# EAGLE design schemat (EAGLE 8.7.1)
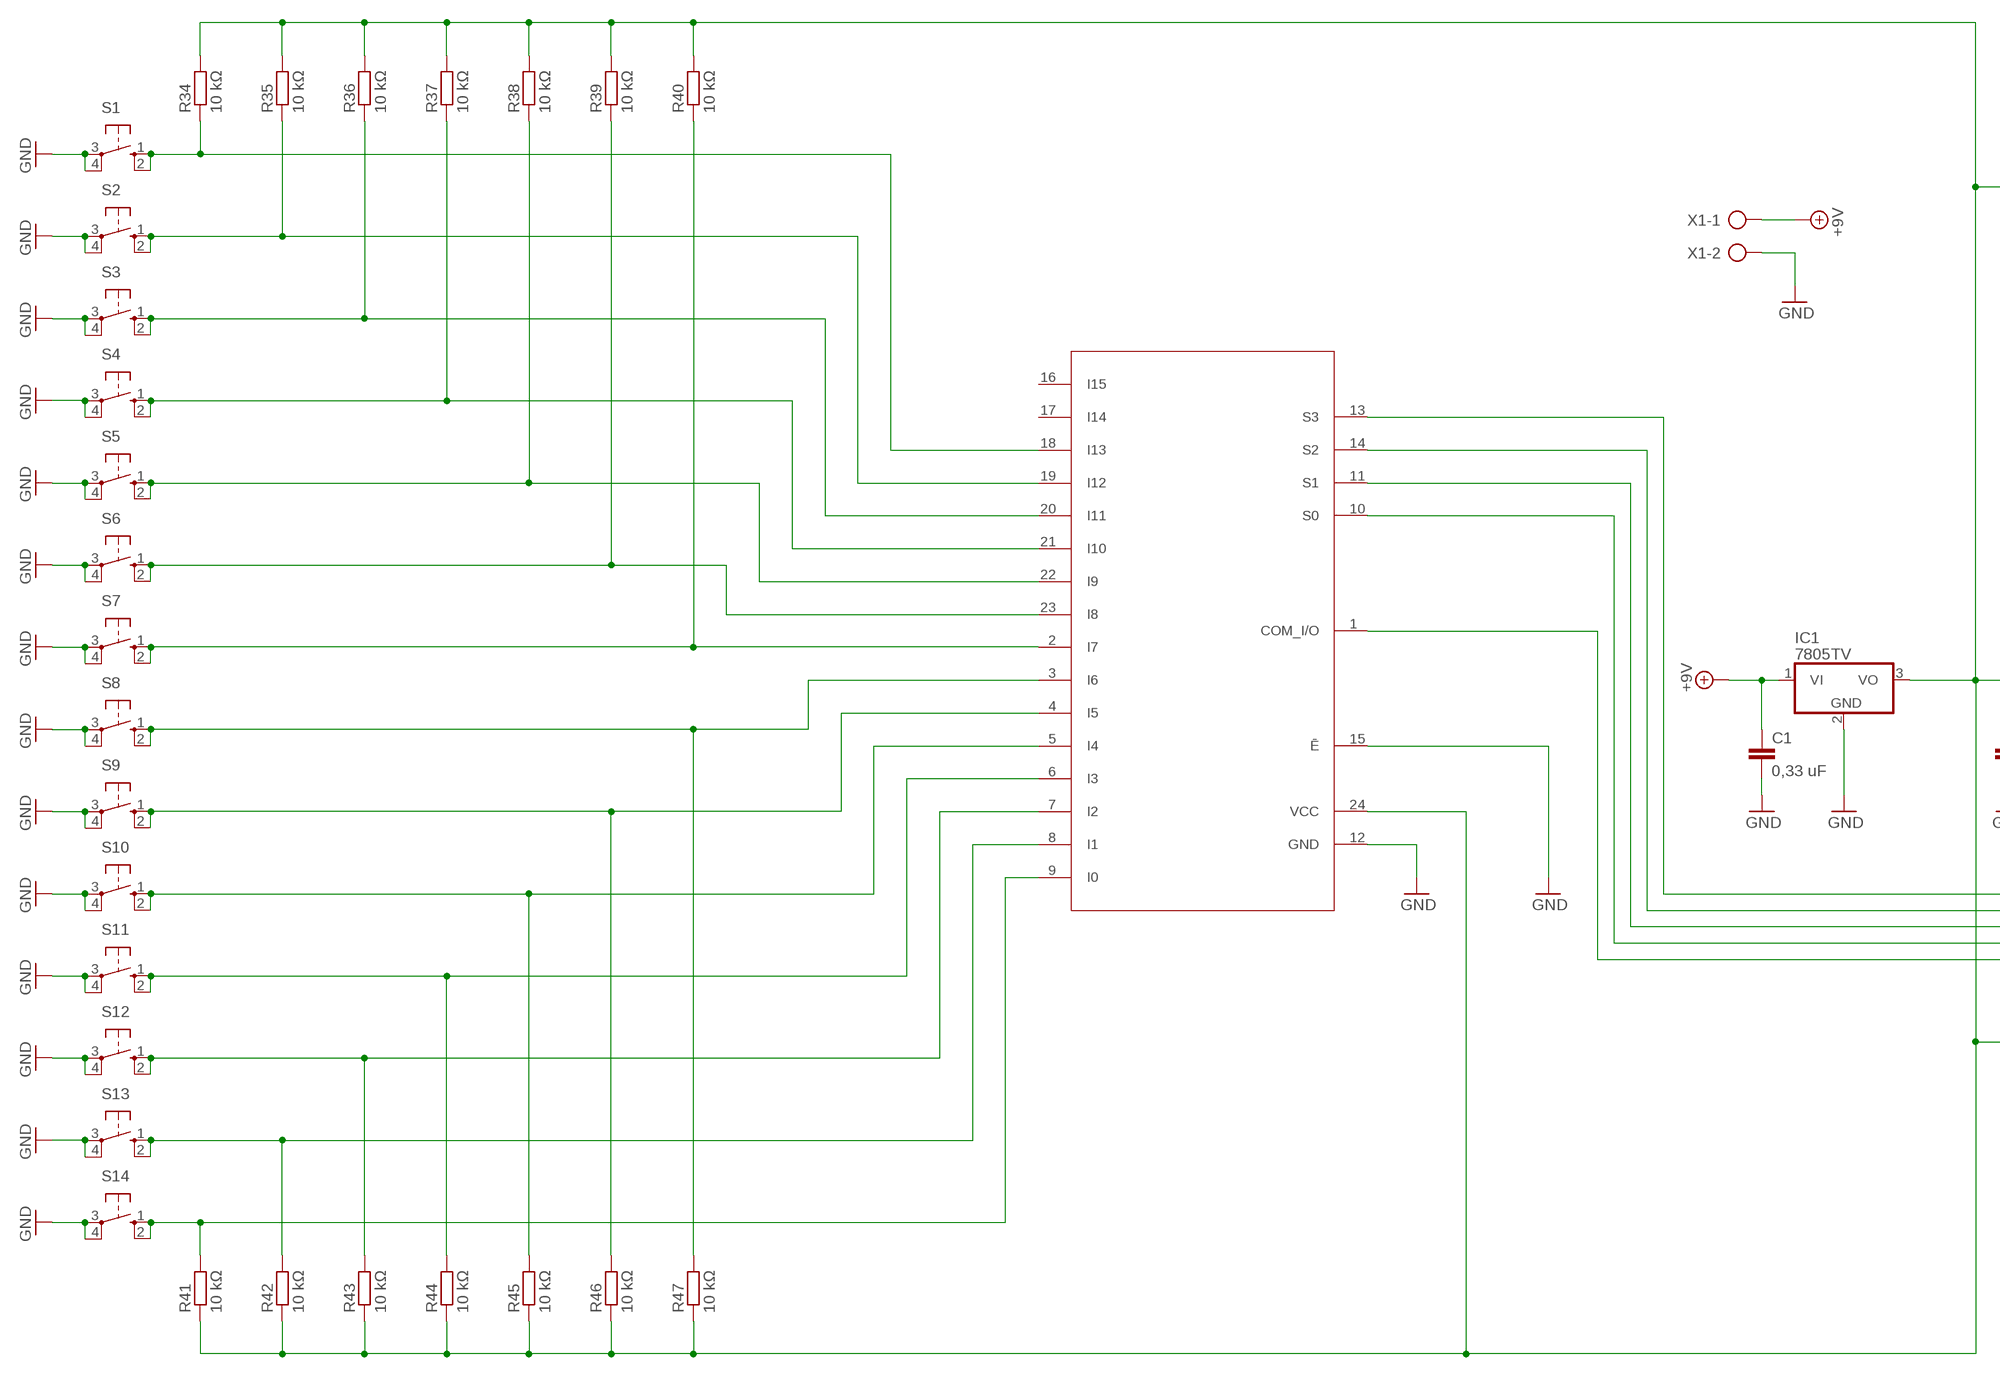
[diagram p0: schematic, sheet 1, part 1 of 2]
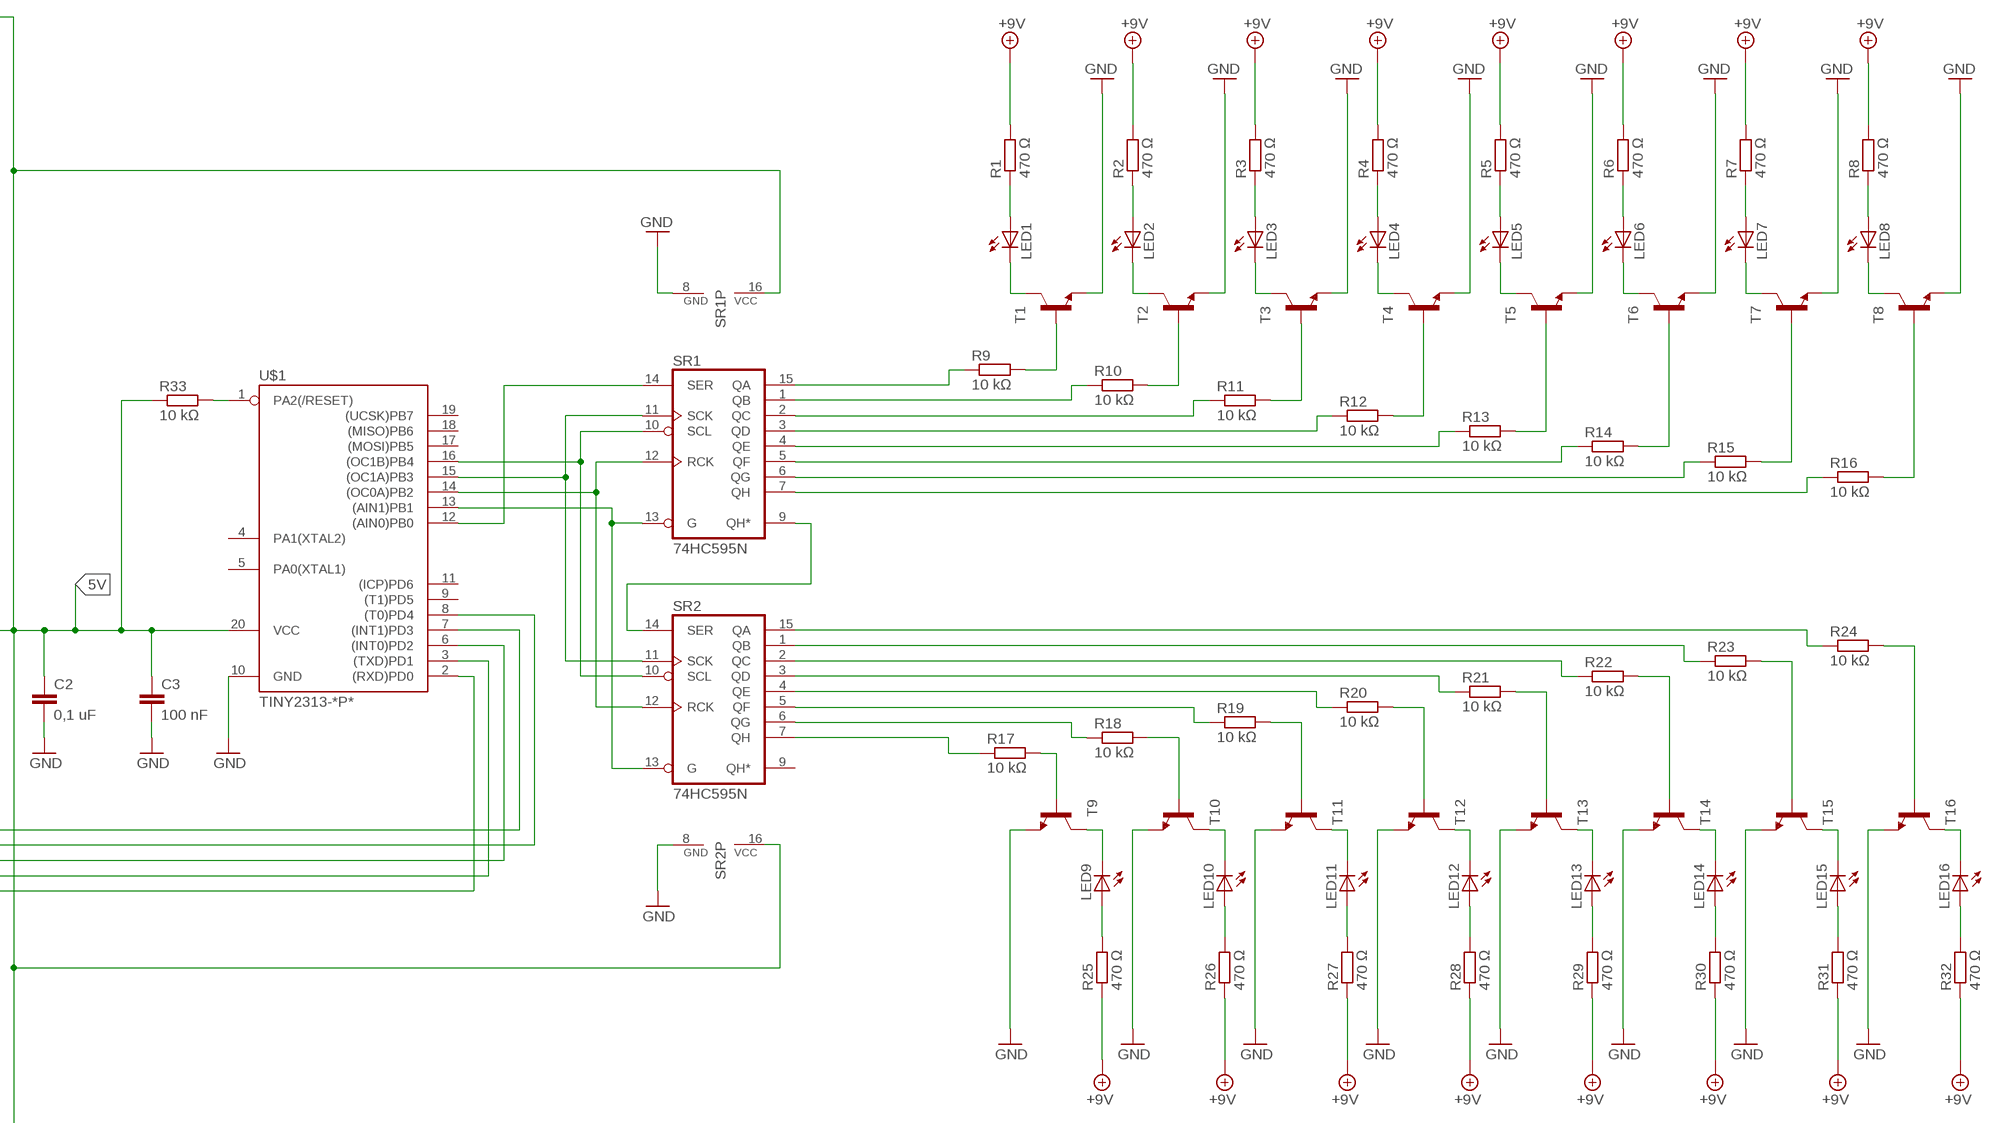
[diagram p1: schematic, sheet 1, part 2 of 2]

## Parts
C1  0,33 uF  C-EU025-024X044  [C025-024X044]
C2  0,1 uF  C-EU025-024X044  [C025-024X044]
C3  100 nF  C-EU025-024X044  [C025-024X044]
IC1  7805TV  [TO220V]
LED1  LED5MM  [LED5MM]
LED2  LED5MM  [LED5MM]
LED3  LED5MM  [LED5MM]
LED4  LED5MM  [LED5MM]
LED5  LED5MM  [LED5MM]
LED6  LED5MM  [LED5MM]
LED7  LED5MM  [LED5MM]
LED8  LED5MM  [LED5MM]
LED9  LED5MM  [LED5MM]
LED10  LED5MM  [LED5MM]
LED11  LED5MM  [LED5MM]
LED12  LED5MM  [LED5MM]
LED13  LED5MM  [LED5MM]
LED14  LED5MM  [LED5MM]
LED15  LED5MM  [LED5MM]
LED16  LED5MM  [LED5MM]
R1  470 Ω  R-EU_0207/10  [0207/10]
R2  470 Ω  R-EU_0207/10  [0207/10]
R3  470 Ω  R-EU_0207/10  [0207/10]
R4  470 Ω  R-EU_0207/10  [0207/10]
R5  470 Ω  R-EU_0207/10  [0207/10]
R6  470 Ω  R-EU_0207/10  [0207/10]
R7  470 Ω  R-EU_0207/10  [0207/10]
R8  470 Ω  R-EU_0207/10  [0207/10]
R9  10 kΩ  R-EU_0207/10  [0207/10]
R10  10 kΩ  R-EU_0207/10  [0207/10]
R11  10 kΩ  R-EU_0207/10  [0207/10]
R12  10 kΩ  R-EU_0207/10  [0207/10]
R13  10 kΩ  R-EU_0207/10  [0207/10]
R14  10 kΩ  R-EU_0207/10  [0207/10]
R15  10 kΩ  R-EU_0207/10  [0207/10]
R16  10 kΩ  R-EU_0207/10  [0207/10]
R17  10 kΩ  R-EU_0207/10  [0207/10]
R18  10 kΩ  R-EU_0207/10  [0207/10]
R19  10 kΩ  R-EU_0207/10  [0207/10]
R20  10 kΩ  R-EU_0207/10  [0207/10]
R21  10 kΩ  R-EU_0207/10  [0207/10]
R22  10 kΩ  R-EU_0207/10  [0207/10]
R23  10 kΩ  R-EU_0207/10  [0207/10]
R24  10 kΩ  R-EU_0207/10  [0207/10]
R25  470 Ω  R-EU_0207/10  [0207/10]
R26  470 Ω  R-EU_0207/10  [0207/10]
R27  470 Ω  R-EU_0207/10  [0207/10]
R28  470 Ω  R-EU_0207/10  [0207/10]
R29  470 Ω  R-EU_0207/10  [0207/10]
R30  470 Ω  R-EU_0207/10  [0207/10]
R31  470 Ω  R-EU_0207/10  [0207/10]
R32  470 Ω  R-EU_0207/10  [0207/10]
R33  10 kΩ  R-EU_0207/10  [0207/10]
R34  10 kΩ  R-EU_0207/10  [0207/10]
R35  10 kΩ  R-EU_0207/10  [0207/10]
R36  10 kΩ  R-EU_0207/10  [0207/10]
R37  10 kΩ  R-EU_0207/10  [0207/10]
R38  10 kΩ  R-EU_0207/10  [0207/10]
R39  10 kΩ  R-EU_0207/10  [0207/10]
R40  10 kΩ  R-EU_0207/10  [0207/10]
R41  10 kΩ  R-EU_0207/10  [0207/10]
R42  10 kΩ  R-EU_0207/10  [0207/10]
R43  10 kΩ  R-EU_0207/10  [0207/10]
R44  10 kΩ  R-EU_0207/10  [0207/10]
R45  10 kΩ  R-EU_0207/10  [0207/10]
R46  10 kΩ  R-EU_0207/10  [0207/10]
R47  10 kΩ  R-EU_0207/10  [0207/10]
S1  40-XX  [B3F-40XX]
S2  40-XX  [B3F-40XX]
S3  40-XX  [B3F-40XX]
S4  40-XX  [B3F-40XX]
S5  40-XX  [B3F-40XX]
S6  40-XX  [B3F-40XX]
S7  40-XX  [B3F-40XX]
S8  40-XX  [B3F-40XX]
S9  40-XX  [B3F-40XX]
S10  40-XX  [B3F-40XX]
S11  40-XX  [B3F-40XX]
S12  40-XX  [B3F-40XX]
S13  40-XX  [B3F-40XX]
S14  40-XX  [B3F-40XX]
SR1  74HC595N  [DIL16]
SR2  74HC595N  [DIL16]
T1  -NPN-TO92  [TO92]
T2  -NPN-TO92  [TO92]
T3  -NPN-TO92  [TO92]
T4  -NPN-TO92  [TO92]
T5  -NPN-TO92  [TO92]
T6  -NPN-TO92  [TO92]
T7  -NPN-TO92  [TO92]
T8  -NPN-TO92  [TO92]
T9  -NPN-TO92  [TO92]
T10  -NPN-TO92  [TO92]
T11  -NPN-TO92  [TO92]
T12  -NPN-TO92  [TO92]
T13  -NPN-TO92  [TO92]
T14  -NPN-TO92  [TO92]
T15  -NPN-TO92  [TO92]
T16  -NPN-TO92  [TO92]
U$1  TINY2313-*P*  [DIL20]
U$2  CD74HC4067  [DIL24-6]
X1  AK500/2  [AK500/2]

## Nets
5V: C2.1 C3.1 IC1.3(VO) R33.1 R34.2 R35.2 R36.2 R37.2 R38.2 R39.2 R40.2 R41.1 R42.1 R43.1 R44.1 R45.1 R46.1 R47.1 SR1.16(VCC) SR2.16(VCC) U$1.20(VCC) U$2.24(VCC)
+9V: C1.1 IC1.1(VI) R1.2 R2.2 R3.2 R4.2 R5.2 R6.2 R7.2 R8.2 R25.1 R26.1 R27.1 R28.1 R29.1 R30.1 R31.1 R32.1 X1.1
GND: C1.2 C2.2 C3.2 IC1.2(GND) S1.3(P) S1.4(P1) S2.3(P) S2.4(P1) S3.3(P) S3.4(P1) S4.3(P) S4.4(P1) S5.3(P) S5.4(P1) S6.3(P) S6.4(P1) S7.3(P) S7.4(P1) S8.3(P) S8.4(P1) S9.3(P) S9.4(P1) S10.3(P) S10.4(P1) S11.3(P) S11.4(P1) S12.3(P) S12.4(P1) S13.3(P) S13.4(P1) S14.3(P) S14.4(P1) SR1.8(GND) SR2.8(GND) T1.1(E) T2.1(E) T3.1(E) T4.1(E) T5.1(E) T6.1(E) T7.1(E) T8.1(E) T9.1(E) T10.1(E) T11.1(E) T12.1(E) T13.1(E) T14.1(E) T15.1(E) T16.1(E) U$1.10(GND) U$2.12(GND) U$2.15(Ē) X1.2
N$1: SR1.9(QH*) SR2.14(SER)
N$2: SR1.12(RCK) SR2.12(RCK) U$1.14((OC0A)PB2)
N$3: R33.2 U$1.1(PA2(/RESET))
N$4: R42.2 S13.1(S) S13.2(S1) U$2.8(I1)
N$5: R43.2 S12.1(S) S12.2(S1) U$2.7(I2)
N$6: SR1.10(SCL) SR2.10(SCL) U$1.16((OC1B)PB4)
N$7: LED1.A R1.1
N$8: R9.2 T1.2(B)
N$9: R10.1 SR1.1(QB)
N$10: R10.2 T2.2(B)
N$11: R9.1 SR1.15(QA)
N$12: R11.2 T3.2(B)
N$13: R11.1 SR1.2(QC)
N$14: R12.2 T4.2(B)
N$15: R12.1 SR1.3(QD)
N$16: R13.2 T5.2(B)
N$17: R13.1 SR1.4(QE)
N$18: R14.1 SR1.5(QF)
N$19: R14.2 T6.2(B)
N$20: R15.2 T7.2(B)
N$21: R16.2 T8.2(B)
N$22: R15.1 SR1.6(QG)
N$23: R16.1 SR1.7(QH)
N$24: LED1.K(C) T1.3(C)
N$25: LED2.K(C) T2.3(C)
N$26: LED3.K(C) T3.3(C)
N$27: LED4.K(C) T4.3(C)
N$28: LED5.K(C) T5.3(C)
N$29: LED6.K(C) T6.3(C)
N$30: LED7.K(C) T7.3(C)
N$31: LED8.K(C) T8.3(C)
N$32: LED2.A R2.1
N$33: LED3.A R3.1
N$34: LED4.A R4.1
N$35: LED5.A R5.1
N$36: LED6.A R6.1
N$37: LED7.A R7.1
N$38: LED8.A R8.1
N$39: LED9.A R25.2
N$40: R17.2 T9.2(B)
N$41: LED9.K(C) T9.3(C)
N$42: LED10.K(C) T10.3(C)
N$43: LED11.K(C) T11.3(C)
N$44: LED12.K(C) T12.3(C)
N$45: LED13.K(C) T13.3(C)
N$46: LED14.K(C) T14.3(C)
N$47: LED15.K(C) T15.3(C)
N$48: LED16.K(C) T16.3(C)
N$49: R17.1 SR2.7(QH)
N$50: R18.1 SR2.6(QG)
N$51: R18.2 T10.2(B)
N$52: R19.1 SR2.5(QF)
N$53: R19.2 T11.2(B)
N$54: R20.2 T12.2(B)
N$55: R20.1 SR2.4(QE)
N$56: R21.2 T13.2(B)
N$57: R21.1 SR2.3(QD)
N$58: R22.2 T14.2(B)
N$59: R22.1 SR2.2(QC)
N$60: R23.2 T15.2(B)
N$61: R23.1 SR2.1(QB)
N$62: R24.2 T16.2(B)
N$63: R24.1 SR2.15(QA)
N$64: LED10.A R26.2
N$65: LED11.A R27.2
N$66: LED12.A R28.2
N$67: LED13.A R29.2
N$68: LED14.A R30.2
N$69: LED15.A R31.2
N$70: LED16.A R32.2
N$73: R41.2 S14.1(S) S14.2(S1) U$2.9(I0)
N$75: SR1.13(G) SR2.13(G) U$1.13((AIN1)PB1)
N$76: R44.2 S11.1(S) S11.2(S1) U$2.6(I3)
N$77: SR1.11(SCK) SR2.11(SCK) U$1.15((OC1A)PB3)
N$78: R45.2 S10.1(S) S10.2(S1) U$2.5(I4)
N$80: R46.2 S9.1(S) S9.2(S1) U$2.4(I5)
N$82: R47.2 S8.1(S) S8.2(S1) U$2.3(I6)
N$83: R34.1 S1.1(S) S1.2(S1) U$2.18(I13)
N$84: R35.1 S2.1(S) S2.2(S1) U$2.19(I12)
N$85: R36.1 S3.1(S) S3.2(S1) U$2.20(I11)
N$87: R37.1 S4.1(S) S4.2(S1) U$2.21(I10)
N$89: R38.1 S5.1(S) S5.2(S1) U$2.22(I9)
N$91: R39.1 S6.1(S) S6.2(S1) U$2.23(I8)
N$93: R40.1 S7.1(S) S7.2(S1) U$2.2(I7)
N$98: U$1.2((RXD)PD0) U$2.1(COM_I/O)
N$99: U$1.3((TXD)PD1) U$2.10(S0)
N$100: U$1.6((INT0)PD2) U$2.11(S1)
N$101: U$1.8((T0)PD4) U$2.14(S2)
N$102: U$1.7((INT1)PD3) U$2.13(S3)
N$103: SR1.14(SER) U$1.12((AIN0)PB0)
Unconnected: SR2.9(QH*) U$1.4(PA1(XTAL2)) U$1.5(PA0(XTAL1)) U$1.9((T1)PD5) U$1.11((ICP)PD6) U$1.17((MOSI)PB5) U$1.18((MISO)PB6) U$1.19((UCSK)PB7) U$2.16(I15) U$2.17(I14)

## Library data of the parts
C1-C3 = rcl:C-EU: CAPACITOR, European symbol; SPICEPREFIX: C
IC1 = linear:78*: Positive VOLTAGE REGULATOR Source: http://cache.national.com/ds/LM/LM78L05.pdf http://www.fairchildsemi.com/ds/LM/LM7805.pdf
LED1-LED16 = led:LED: LED OSRAM: - CHIPLED LG R971, LG N971, LY N971, LG Q971, LY Q971, LO R971, LY R971 LH N974, LH R974 LS Q976, LO Q976, LY Q976 LO Q996 - Hyper CHIPLED LW Q18S LB Q993, LB Q99A, LB R99A - SideLED LS A670, LO A670, LY A670, LG A670, LP A670 LB A673, LV A673, LT A673, LW A673 LH A674 LY A675 LS A676, LA A676, LO A676, LY A676, LW A676 LS A679, LY A679, LG A679 - Hyper Micro SIDELED® LS Y876, LA Y876, LO Y876, LY Y876 LT Y87S - SmartLED LW L88C, LW L88S LB L89C, LB L89S, LG L890 LS L89K, LO L89K, LY L89K LS L896, LA L896, LO L896, LY L896 - TOPLED LS T670, LO T670, LY T670, LG T670, LP T670 LSG T670, LSP T670, LSY T670, LOP T670, LYG T670 LG T671, LOG T671, LSG T671 LB T673, LV T673, LT T673, LW T673 LH T674 LS T676, LA T676, LO T676, LY T676, LB T676, LH T676, LSB T676, LW T676 LB T67C, LV T67C, LT T67C, LS T67K, LO T67K, LY T67K, LW E67C LS E67B, LA E67B, LO E67B, LY E67B, LB E67C, LV E67C, LT E67C LW T67C LS T679, LY T679, LG T679 LS T770, LO T770, LY T770, LG T770, LP T770 LB T773, LV T773, LT T773, LW T773 LH T774 LS E675, LA E675, LY E675, LS T675 LS T776, LA T776, LO T776, LY T776, LB T776 LHGB T686 LT T68C, LB T68C - Hyper Mini TOPLED® LB M676 - Mini TOPLED Santana® LG M470 LS M47K, LO M47K, LY M47K Source: http://www.osram.convergy.de LUXEON: - LUMILED® LXK2-PW12-R00, LXK2-PW12-S00, LXK2-PW14-U00, LXK2-PW14-V00 LXK2-PM12-R00, LXK2-PM12-S00, LXK2-PM14-U00 LXK2-PE12-Q00, LXK2-PE12-R00, LXK2-PE12-S00, LXK2-PE14-T00, LXK2-PE14-U00 LXK2-PB12-K00, LXK2-PB12-L00, LXK2-PB12-M00, LXK2-PB14-N00, LXK2-PB14-P00, LXK2-PB14-Q00 LXK2-PR12-L00, LXK2-PR12-M00, LXK2-PR14-Q00, LXK2-PR14-R00 LXK2-PD12-Q00, LXK2-PD12-R00, LXK2-PD12-S00 LXK2-PH12-R00, LXK2-PH12-S00 LXK2-PL12-P00, LXK2-PL12-Q00, LXK2-PL12-R00 Source: www.luxeon.com KINGBRIGHT: KA-3528ASYC Source: www.kingbright.com
R1-R47 = rcl:R-EU_: RESISTOR, European symbol; SPICEPREFIX: R
S1-S14 = switch-omron:40-XX: OMRON SWITCH; MF: OMRON COMPONENTS USA; MPN: B3F-4000; OC_FARNELL: 176434; OC_NEWARK: 36K3105
SR1 = 74xx-eu:74*595: 8-bit SHIFT REGISTER, output latch; SPICEPREFIX: I
SR2 = 74xx-eu:74*595: 8-bit SHIFT REGISTER, output latch
T1-T16 = transistor:*-NPN-: NPN Transistror BF959 corrected 2008.03.06
U$1 = avr-6:TINY2313*: Atmel Tiny2313 2K Flash, 128 bytes EEPROM, 128 bytes RAM
U$2 = _mux:CD74HC4067
X1 = con-ptr500:AK500/2: CONNECTOR; OC_FARNELL: unknown; OC_NEWARK: unknown

## Board
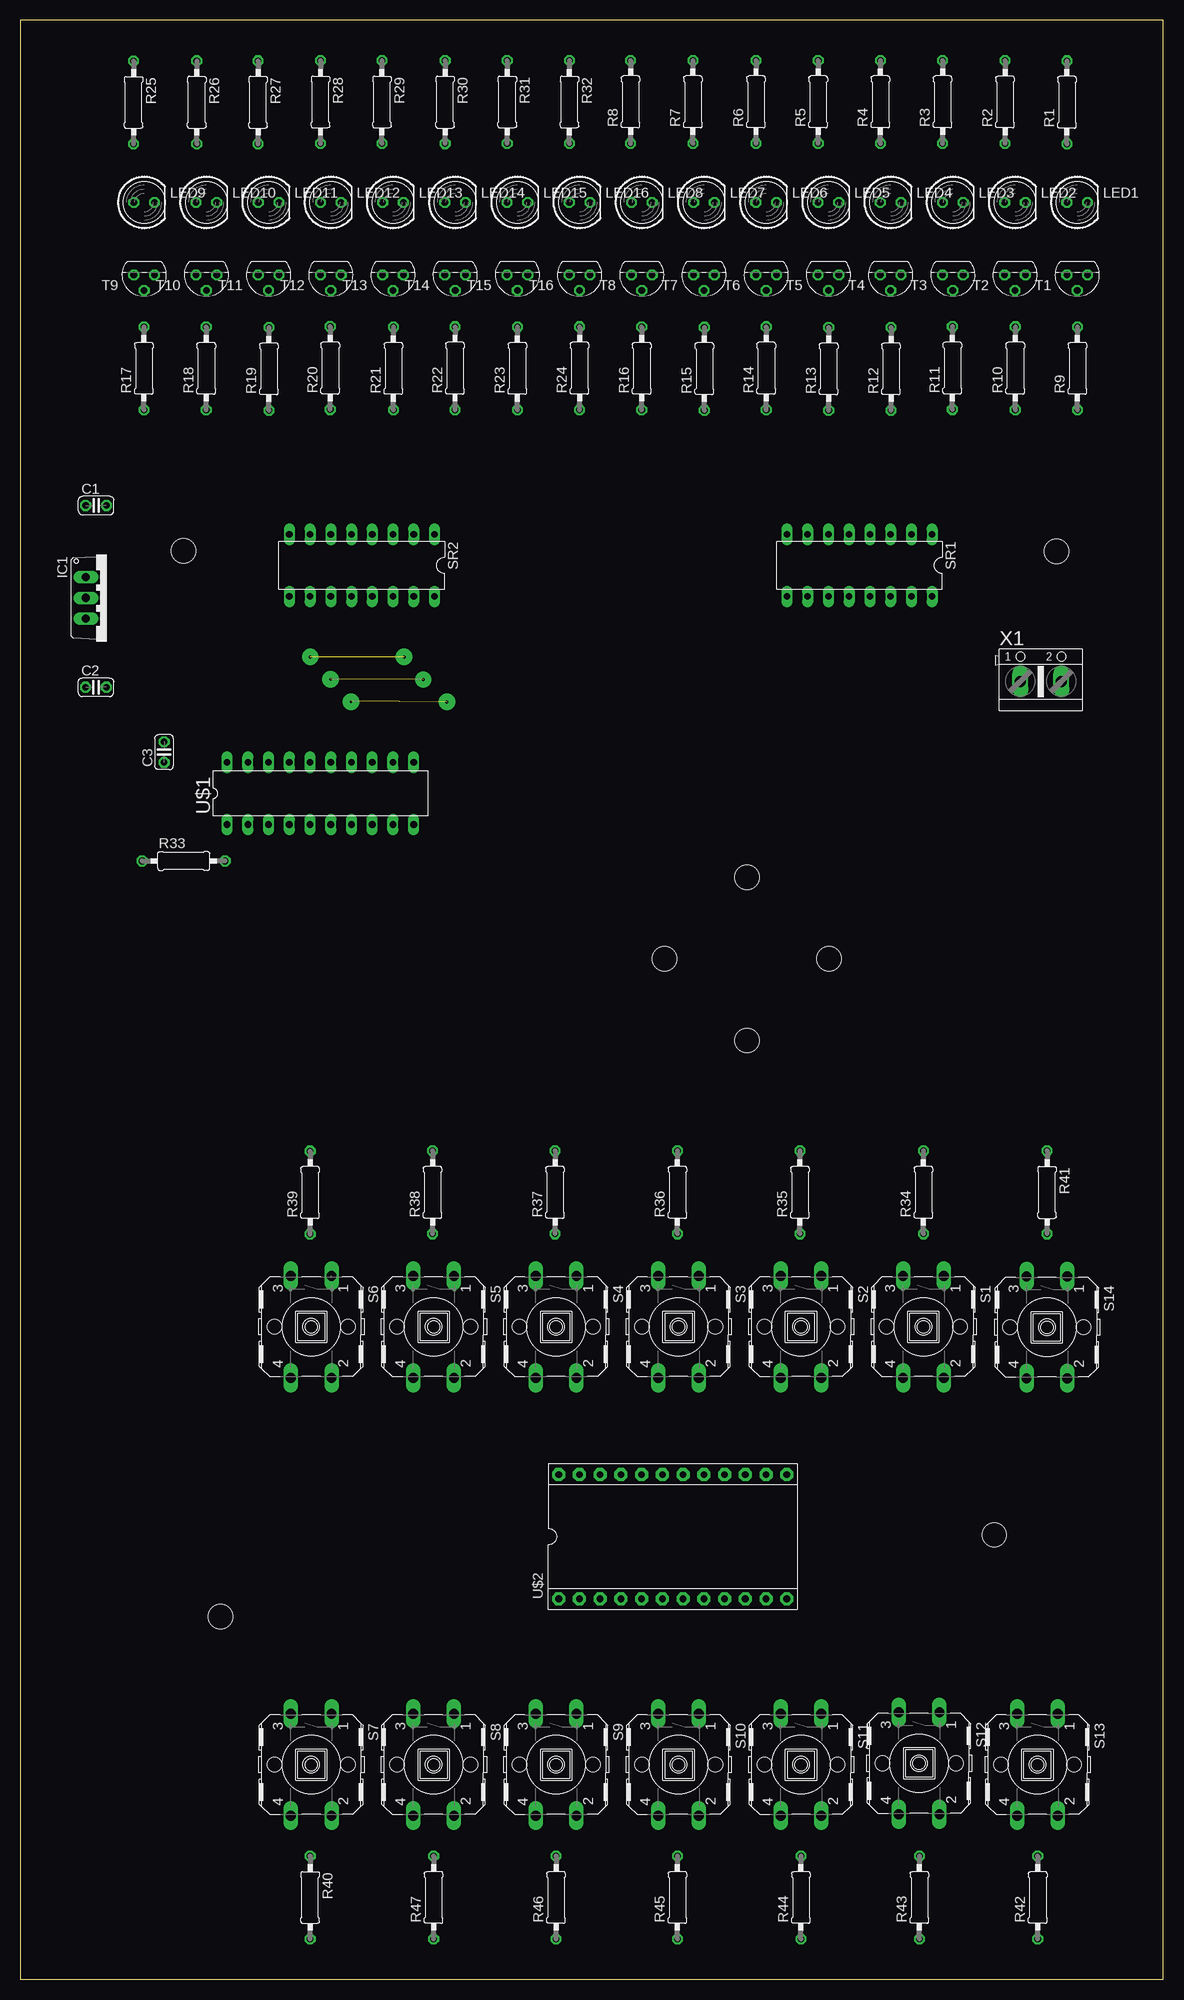
[diagram p2: board, top side]
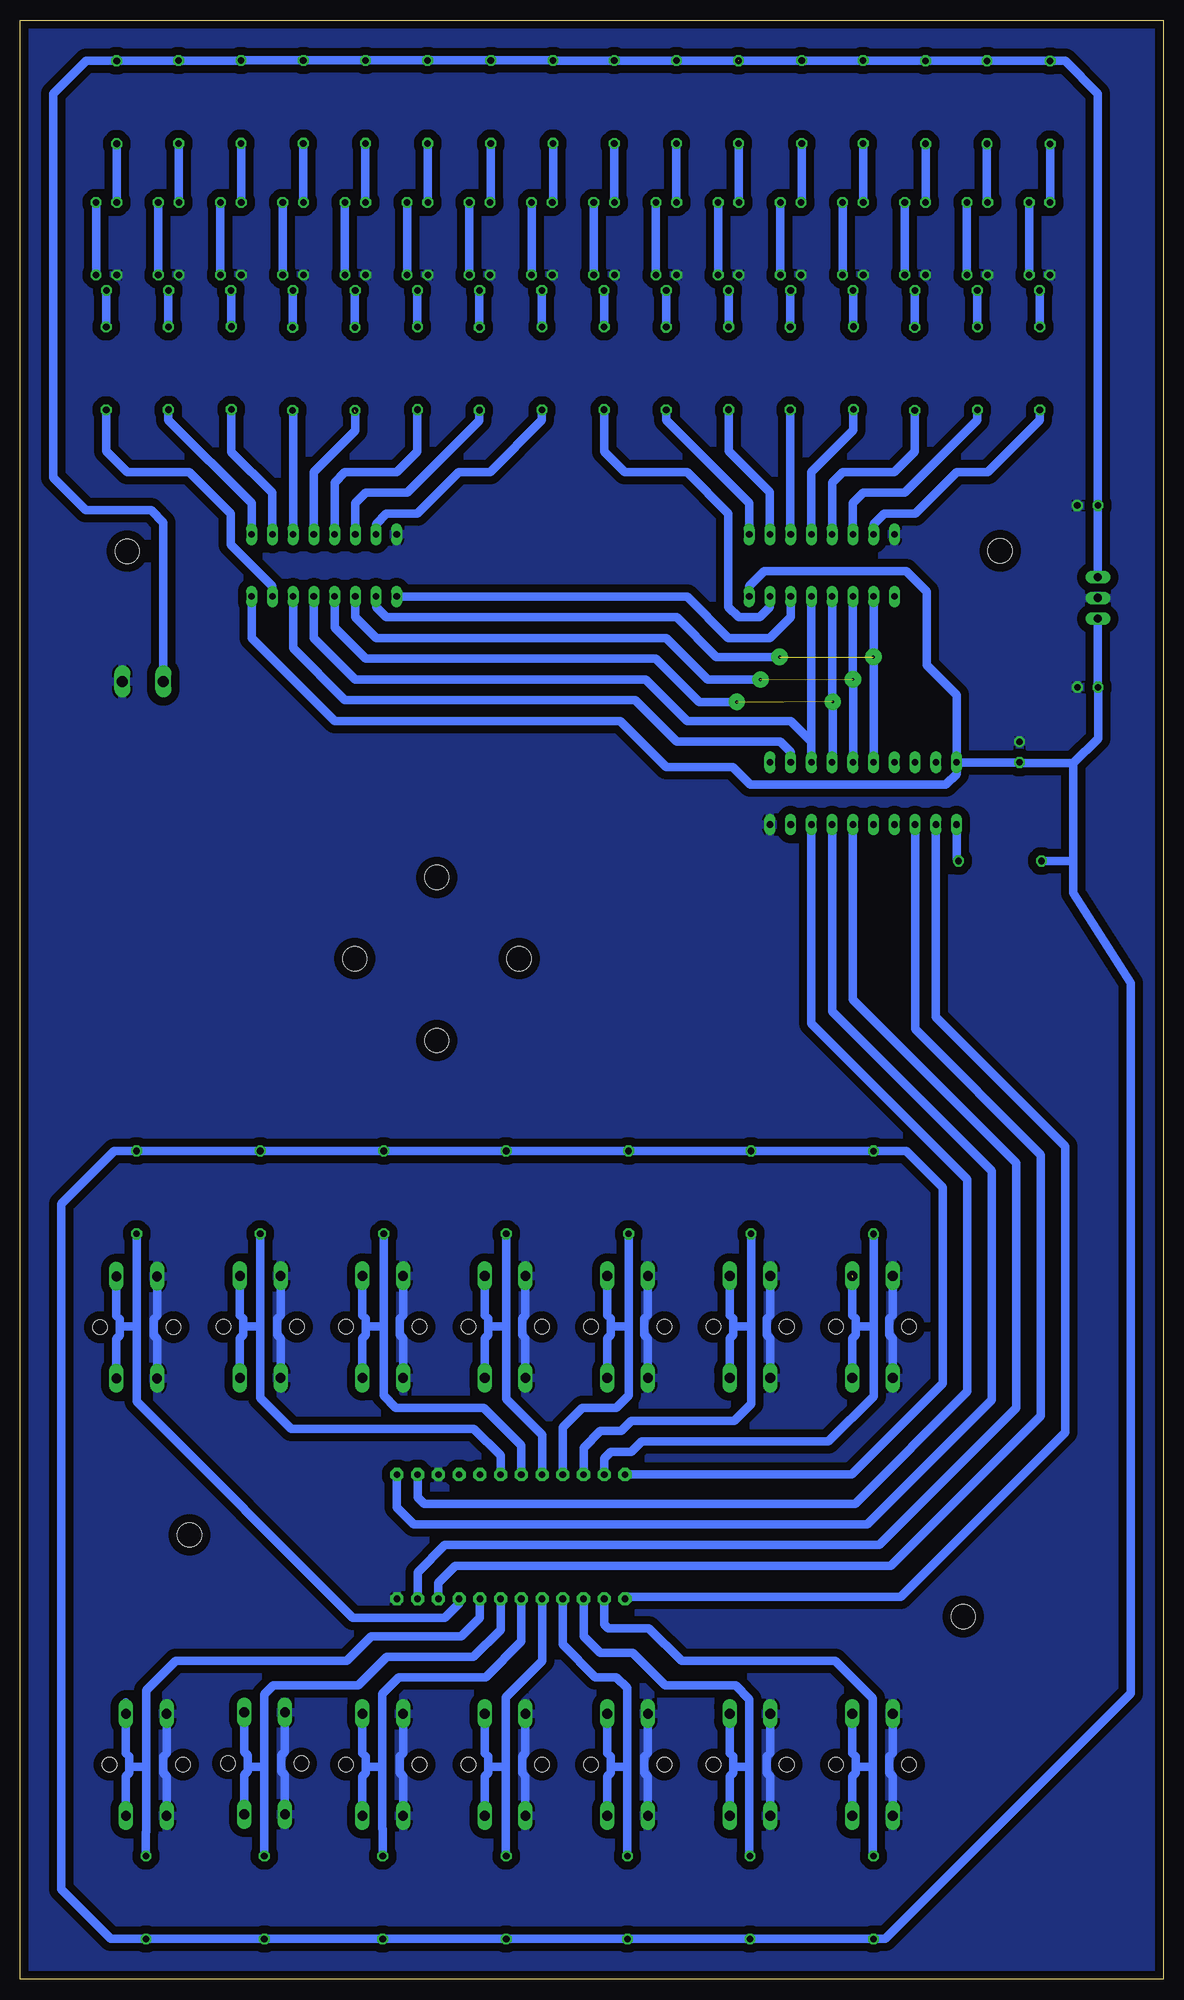
[diagram p3: board, bottom side, seen from below]

Size 140 x 240 mm. Coordinates in mm from the lower left corner, seen from the top.
Outline: 0,0 140,0 140,240 0,240 0,0
Copper layers (1*16): Top 0.035mm / dielectric 1.5mm / Bottom 0.035mm
Design rules "default": minimum track width 6mil, minimum drill 0.35mm, track to track 6mil, track to pad 6mil, pad to pad 6mil, via to via 6mil, smd to smd 6mil, copper to edge 40mil, drill to drill 6mil, minimum pad ring 10mil, minimum via ring 8mil, stop-mask expansion 4mil, vias tented up to drill 0mil, thermal gap 10mil
Holes 3 mm at 19.99,175 126.92,174.96 24.51,44.42 119.28,54.43 78.92,125.03 99.04,125.03 89,135 89,115

### Footprints (pad centres in the part's own frame; a part is rotated, then mirrored left to right if it is on the bottom)
C025-024X044 = drill 0.813 octagon: 1 -1.27,0; 2 1.27,0
TO220V = drill 1.016 long: 1 -2.54,-2.54; 2 0,-2.54; 3 2.54,-2.54
LED5MM = drill 0.813 octagon: A -1.27,0; K 1.27,0
0207/10 = drill 0.813 octagon: 1 -5.08,0; 2 5.08,0
B3F-40XX = drill 1.194 long: 1 -6.248,2.489; 2 6.248,2.489; 3 -6.248,-2.489; 4 6.248,-2.489 | hole 1.803: 0,-4.496; 0,4.496
DIL16 = drill 0.813 long: 1 -8.89,-3.81; 2 -6.35,-3.81; 3 -3.81,-3.81; 4 -1.27,-3.81; 5 1.27,-3.81; 6 3.81,-3.81; 7 6.35,-3.81; 8 8.89,-3.81; 9 8.89,3.81; 10 6.35,3.81; 11 3.81,3.81; 12 1.27,3.81; 13 -1.27,3.81; 14 -3.81,3.81; 15 -6.35,3.81; 16 -8.89,3.81
TO92 = drill 0.813 octagon: 1 1.27,0; 2 0,1.905; 3 -1.27,0
DIL20 = drill 0.813 long: 1 -11.43,-3.81; 2 -8.89,-3.81; 3 -6.35,-3.81; 4 -3.81,-3.81; 5 -1.27,-3.81; 6 1.27,-3.81; 7 3.81,-3.81; 8 6.35,-3.81; 9 8.89,-3.81; 10 11.43,-3.81; 11 11.43,3.81; 12 8.89,3.81; 13 6.35,3.81; 14 3.81,3.81; 15 1.27,3.81; 16 -1.27,3.81; 17 -3.81,3.81; 18 -6.35,3.81; 19 -8.89,3.81; 20 -11.43,3.81
DIL24-6 = drill 0.813 pad 1.6 octagon: 1 -13.97,-7.62; 2 -11.43,-7.62; 3 -8.89,-7.62; 4 -6.35,-7.62; 5 -3.81,-7.62; 6 -1.27,-7.62; 7 1.27,-7.62; 8 3.81,-7.62; 9 6.35,-7.62; 10 8.89,-7.62; 11 11.43,-7.62; 12 13.97,-7.62; 13 13.97,7.62; 14 11.43,7.62; 15 8.89,7.62; 16 6.35,7.62; 17 3.81,7.62; 18 1.27,7.62; 19 -1.27,7.62; 20 -3.81,7.62; 21 -6.35,7.62; 22 -8.89,7.62; 23 -11.43,7.62; 24 -13.97,7.62
AK500/2 = drill 1.321 long: 1 -2.515,0; 2 2.515,0

### Placement (x,y rotation side)
C1  9.27,180.55 0 top
C2  9.26,158.3 0 top
C3  17.61,150.34 90 top
IC1  10.55,169.24 270 top
LED1  129.46,217.7 0 top
LED2  121.84,217.7 0 top
LED3  114.22,217.7 0 top
LED4  106.6,217.7 0 top
LED5  98.98,217.7 0 top
LED6  91.36,217.7 0 top
LED7  83.74,217.7 0 top
LED8  76.12,217.7 0 top
LED9  15.16,217.7 0 top
LED10  22.78,217.7 0 top
LED11  30.4,217.7 0 top
LED12  38.02,217.7 0 top
LED13  45.64,217.7 0 top
LED14  53.26,217.7 0 top
LED15  60.88,217.7 0 top
LED16  68.5,217.7 0 top
R1  128.21,229.97 90 top
R2  120.62,230 90 top
R3  112.97,230.02 90 top
R4  105.35,230.02 90 top
R5  97.73,230.02 90 top
R6  90.11,230.02 90 top
R7  82.38,230.02 90 top
R8  74.75,230.02 90 top
R9  129.49,197.37 90 top
R10  121.87,197.38 90 top
R11  114.16,197.4 90 top
R12  106.65,197.3 90 top
R13  99.02,197.3 90 top
R14  91.36,197.38 90 top
R15  83.78,197.32 90 top
R16  76.11,197.37 90 top
R17  15.13,197.37 90 top
R18  22.76,197.37 90 top
R19  30.44,197.3 90 top
R20  37.95,197.4 90 top
R21  45.7,197.35 90 top
R22  53.24,197.38 90 top
R23  60.89,197.35 90 top
R24  68.49,197.38 90 top
R25  13.86,229.95 270 top
R26  21.6,229.97 270 top
R27  29.11,229.97 270 top
R28  36.76,230 270 top
R29  44.29,230 270 top
R30  52.03,229.98 270 top
R31  59.63,230 270 top
R32  67.25,230 270 top
R33  20,137 0 top
R34  110.62,96.4 90 top
R35  95.49,96.4 90 top
R36  80.49,96.4 90 top
R37  65.49,96.4 90 top
R38  50.49,96.4 90 top
R39  35.49,96.38 90 top
R40  35.49,10 270 top
R41  125.76,96.4 270 top
R42  124.62,10 90 top
R43  110.13,10 90 top
R44  95.62,10 90 top
R45  80.49,10 90 top
R46  65.62,10 90 top
R47  50.62,10 90 top
S1  110.62,79.92 270 top
S2  95.62,79.92 270 top
S3  80.62,79.92 270 top
S4  65.62,79.92 270 top
S5  50.62,79.92 270 top
S6  35.62,79.92 270 top
S7  35.62,26.27 270 top
S8  50.62,26.27 270 top
S9  65.62,26.27 270 top
S10  80.62,26.27 270 top
S11  95.62,26.27 270 top
S12  110.09,26.44 270 top
S13  124.59,26.27 270 top
S14  125.75,79.86 270 top
SR1  102.79,173.22 180 top
SR2  41.83,173.22 180 top
T1  129.46,208.81 180 top
T2  121.84,208.81 180 top
T3  114.22,208.81 180 top
T4  106.6,208.81 180 top
T5  98.98,208.81 180 top
T6  91.36,208.81 180 top
T7  83.74,208.81 180 top
T8  76.12,208.81 180 top
T9  15.16,208.81 180 top
T10  22.78,208.81 180 top
T11  30.4,208.81 180 top
T12  38.02,208.81 180 top
T13  45.64,208.81 180 top
T14  53.26,208.81 180 top
T15  60.88,208.81 180 top
T16  68.5,208.81 180 top
U$1  36.75,145.28 0 top
U$2  79.91,54.21 0 top
X1  125,159 0 top

### Tracks (layer width: path | path; a pad name or v marks a point on that pad's centre or on a via)
5V
  Bottom 1.016: SR2.16 50.72,170.68 48.89,172.51 31.51,172.51 29,170 29,161 25.32,157.32 U$1.20 | SR1.16 111.68,164.33 101.52,154.17 66.51,154.17 60.88,148.54 52.75,148.54 50.58,146.37 26.63,146.37 25.32,147.68 U$1.20 | U$2.24 38.17,61.83 27,73 27,97 31.46,101.46 R39.2 50.48,101.46 R38.2 R37.2 R36.2 R35.2 R34.2 R41.1 128.52,101.48 135,95 135,11 128.92,4.92 R42.1 R43.1 R44.1 R45.1 R46.1 R47.1 R40.2 34.08,4.92 4,35 4,122.08 11,133.08 11,137 | U$1.20 25.32,149 25.21,149.11 | 25,149.09 U$1.20 | U$1.20 25.3,149.07 C3.1 17.53,149 11,149 | 11,149 11,137 | 11,137 R33.1 | IC1.3 8.02,158.33 C2.1 7.99,152.01 11,149
+9V  (1 unrouted)
  Bottom 1.016: 52,235 52.08,235.08 R31.1 R32.1 74.73,235.08 R8.2 R7.2 R6.2 R5.2 R4.2 R3.2 112.98,235.08 R2.2 120.65,235.05 R1.2 131.95,235.05 136,231 136,184 132,180 124,180 122.48,178.49 X1.1 | R30.1 44.3,235.06 R29.1 R28.1 29.14,235.08 R27.1 R26.1 13.87,235.05 R25.1 12.03,235.03 8,231 8,184.49 C1.1 8,171.79 IC1.1
GND
  Bottom 1.016: S6.4 33.13,78.5 33.55,78.92 33.55,80.92 33.13,81.34 S6.3 | S5.4 48.13,78.5 48.55,78.92 48.55,80.92 48.13,81.34 S5.3 | S4.4 63.13,78.5 63.55,78.92 63.55,80.92 63.13,81.34 S4.3 | S3.4 78.13,78.5 78.55,78.92 78.55,80.92 78.13,81.34 S3.3 | S2.4 93.13,78.5 93.55,78.92 93.55,80.92 93.13,81.34 S2.3 | S1.4 108.13,78.5 108.55,78.92 108.55,80.92 108.13,81.34 S1.3 | S7.4 33.13,24.85 33.55,25.27 33.55,27.27 33.13,27.69 S7.3 | S8.4 48.13,24.85 48.55,25.27 48.55,27.27 48.13,27.69 S8.3 | S9.4 63.13,24.85 63.55,25.27 63.55,27.27 63.13,27.69 S9.3 | S10.4 78.13,24.85 78.55,25.27 78.55,27.27 78.13,27.69 S10.3 | S11.4 93.13,24.85 93.55,25.27 93.55,27.27 93.13,27.69 S11.3 | S12.4 107.6,25.02 108.02,25.43 108.02,27.45 107.6,27.86 S12.3 | S13.3 122.1,27.69 122.52,27.27 122.52,25.27 122.1,24.85 S13.4 | S14.3 123.26,81.29 123.68,80.87 123.68,78.86 123.26,78.44 S14.4
  pour Bottom (isolate 1): 0,0 140,0 140,240 0,240
N$1
  Bottom 1.016: SR1.9 58.34,169.41 53.26,164.33 48.18,164.33 45.64,166.87 SR2.14
N$2  (via drill 0.35 pad 2)  (1 unrouted)
  Bottom 1.016: SR1.12 101.52,165.6 97.71,161.79 62.15,161.79 56.85,156.49 v52.24,156.49 | SR2.12 40.56,156.58 v40.49,156.51 40.49,149.16 U$1.14
N$3
  Bottom 1.016: U$1.1 25.32,137.24 R33.2
N$4
  Bottom 1.016: U$2.8 83.72,44.28 86,42 97,42 100,39 121,39 124.6,35.4 124.6,26 | 127.08,33.92 S13.1 127.08,27.69 126.66,27.27 126.66,26 | S13.2 127.08,24.85 126.66,25.27 126.66,26 | 124.6,26 124.6,18.03 124.62,18.02 R42.2 | 124.6,26 126.66,26
N$5
  Bottom 1.016: U$2.7 81.18,42.82 84.54,39.46 95.12,39.46 98.59,36 109,36 110.12,34.88 110.12,26 | 112.58,33.42 S12.1 112.58,27.86 112.16,27.45 112.16,26 | S12.2 112.58,25.02 112.16,25.43 112.16,26 | 110.12,26 112.16,26 | R43.2 110.12,26
N$6  (via drill 0.35 pad 2)  (1 unrouted)
  Bottom 1.016: SR1.10 96.44,168.14 95.17,166.87 59.61,166.87 54.74,162 v47,162 | SR2.10 35.48,162.03 | 35.48,162.03 v35.51,162 | U$1.16 35.48,162.03
N$7
  Bottom 1.016: R1.1 128.21,217.72 LED1.A
N$8
  Bottom 1.016: R9.2 129.49,206.87 T1.2
N$9
  Bottom 1.016: SR1.1 111.68,180.84 121.87,191.03 R10.1
N$10
  Bottom 1.016: R10.2 121.87,206.87 T2.2
N$11
  Bottom 1.016: SR1.15 109.14,170.68 114.22,175.76 114.22,179.57 119.3,184.65 126.92,184.65 129.49,187.22 R9.1
N$12
  Bottom 1.016: R11.2 114.16,206.84 T3.2
N$13
  Bottom 1.016: SR1.2 109.14,182.11 114.16,187.13 R11.1
N$14
  Bottom 1.016: R12.2 106.65,206.85 T4.2
N$15
  Bottom 1.016: SR1.3 106.6,192.17 R12.1
N$16
  Bottom 1.016: R13.2 99.02,206.87 T5.2
N$17  (1 unrouted)
  Bottom 1.016: SR1.4 104.06,184.65 99,189.71 99,192
N$18
  Bottom 1.016: SR1.5 101.52,183.38 100.25,184.65 93.9,184.65 91.36,187.19 R14.1
N$19
  Bottom 1.016: R14.2 T6.2
N$20
  Bottom 1.016: R15.2 83.78,206.87 T7.2
N$21
  Bottom 1.016: R16.2 76.11,206.9 T8.2
N$22
  Bottom 1.016: SR1.6 98.98,180.84 97.71,182.11 92.63,182.11 83.78,190.96 R15.1
N$23
  Bottom 1.016: SR1.7 96.44,178.3 95.17,179.57 91.36,179.57 86.28,184.65 82.47,184.65 76.11,191.01 R16.1
N$24
  Bottom 1.016: T1.3 LED1.K
N$25
  Bottom 1.016: T2.3 LED2.K
N$26
  Bottom 1.016: T3.3 LED3.K
N$27
  Bottom 1.016: T4.3 LED4.K
N$28
  Bottom 1.016: T5.3 LED5.K
N$29
  Bottom 1.016: T6.3 LED6.K
N$30
  Bottom 1.016: T7.3 LED7.K
N$31
  Bottom 1.016: T8.3 LED8.K
N$32
  Bottom 1.016: R2.1 120.62,217.75 LED2.A
N$33
  Bottom 1.016: R3.1 112.97,217.72 LED3.A
N$34
  Bottom 1.016: R4.1 105.35,217.72 LED4.A
N$35
  Bottom 1.016: R5.1 97.73,217.72 LED5.A
N$36
  Bottom 1.016: R6.1 90.11,217.72 LED6.A
N$37
  Bottom 1.016: R7.1 82.38,217.79 LED7.A
N$38
  Bottom 1.016: R8.1 74.75,217.8 LED8.A
N$39
  Bottom 1.016: R25.2 13.86,217.73 LED9.A
N$40
  Bottom 1.016: R17.2 15.13,206.87 T9.2
N$41
  Bottom 1.016: LED9.K T9.3
N$42
  Bottom 1.016: T10.3 LED10.K
N$43
  Bottom 1.016: T11.3 LED11.K
N$44
  Bottom 1.016: T12.3 LED12.K
N$45
  Bottom 1.016: T13.3 LED13.K
N$46
  Bottom 1.016: T14.3 LED14.K
N$47
  Bottom 1.016: T15.3 LED15.K
N$48
  Bottom 1.016: T16.3 LED16.K
N$49
  Bottom 1.016: SR2.7 35.48,178.3 34.21,179.57 30.4,179.57 25.32,184.65 21.51,184.65 15.13,191.03 R17.1
N$50
  Bottom 1.016: SR2.6 38.02,180.84 36.75,182.11 31.67,182.11 22.76,191.02 R18.1
N$51
  Bottom 1.016: R18.2 22.76,206.89 T10.2
N$52
  Bottom 1.016: SR2.5 40.56,183.38 39.29,184.65 32.94,184.65 30.44,187.15 R19.1
N$53
  Bottom 1.016: T11.2 30.44,206.86 R19.2
N$54
  Bottom 1.016: R20.2 37.95,206.84 T12.2
N$55
  Bottom 1.016: SR2.4 43.1,184.65 37.95,189.8 R20.1
N$56
  Bottom 1.016: R21.2 45.7,206.85 T13.2
N$57
  Bottom 1.016: SR2.3 45.7,177.09 R21.1
N$58
  Bottom 1.016: R22.2 53.24,206.88 T14.2
N$59
  Bottom 1.016: R22.1 53.24,187.24 48.18,182.18 SR2.2
N$60
  Bottom 1.016: R23.2 60.89,206.9 T15.2
N$61
  Bottom 1.016: SR2.1 50.72,180.84 60.89,191.01 R23.1
N$62
  Bottom 1.016: R24.2 68.49,206.9 T16.2
N$63
  Bottom 1.016: SR2.15 48.18,168.14 49.45,166.87 51.99,166.87 53.26,168.14 53.26,179.57 58.34,184.65 65.96,184.65 68.49,187.18 R24.1
N$64
  Bottom 1.016: R26.2 21.6,217.79 LED10.A
N$65
  Bottom 1.016: R27.2 29.11,217.72 LED11.A
N$66
  Bottom 1.016: R28.2 36.76,217.71 LED12.A
N$67
  Bottom 1.016: R29.2 44.29,217.78 LED13.A
N$68
  Bottom 1.016: R30.2 52.03,217.74 LED14.A
N$69
  Bottom 1.016: R31.2 59.63,217.72 LED15.A
N$70
  Bottom 1.016: R32.2 67.25,217.72 LED16.A
N$73
  Bottom 1.016: U$2.9 86.26,46.04 88.01,44.29 99.29,44.29 125.76,70.76 125.76,80 | S14.2 128.24,78.44 127.82,78.86 127.82,80 | 127.82,80 127.82,80.87 128.24,81.29 S14.1 | R41.2 125.76,80 | 125.76,80 127.82,80
N$75
  Bottom 1.016: SR2.13 43.1,151.63 | 43.1,151.63 U$1.13 | SR1.13 104.06,164.33 98.98,159.25 63.42,159.25 58.34,154.17 45.64,154.17 43.1,151.63
N$76
  Bottom 1.016: U$2.6 78.64,41.36 83,37 93.63,37 95.65,34.98 95.65,26 | S11.2 98.11,24.85 97.69,25.27 97.69,26 | 97.69,26 97.69,27.27 98.11,27.69 S11.1 | 95.65,26 95.65,18.41 95.62,18.39 R44.2 | 95.65,26 97.69,26
N$77  (via drill 0.35 pad 2)  (1 unrouted)
  Bottom 1.016: SR1.11 98.98,166.87 96.44,164.33 60.88,164.33 55.79,159.24 v49.35,159.24 | SR2.11 38.02,159.27 v38,159.25 38,149.11 U$1.15
N$78
  Bottom 1.016: 83.11,32.89 S10.1 83.11,27.69 82.69,27.27 82.69,26 | S10.2 83.11,24.85 82.69,25.27 82.69,26 | 80.53,26 80.53,34.54 76.1,38.98 U$2.5 | 80.53,26 82.69,26 | R45.2 80.53,15.12 80.53,26
N$80
  Bottom 1.016: U$2.4 73.56,41 69.56,37 67,37 65.67,35.67 65.67,26 | 68,32.63 S9.1 68.11,27.69 67.69,27.27 67.69,26 | S9.2 68.11,24.85 67.69,25.27 67.69,26 | 65.67,26 67.69,26 | R46.2 65.67,15.13 65.67,26
N$82
  Bottom 1.016: S8.2 53.11,24.85 52.69,25.27 52.69,26 | 52.69,26 52.69,27.27 53.11,27.69 S8.1 | 50.69,26 50.69,34.29 52.4,36 61,36 65,40 69,40 71.02,42.02 U$2.3 | 50.69,26 50.69,15.15 R47.2 | 50.69,26 52.69,26
N$83
  Bottom 1.016: 112.69,80 112.69,78.92 113.11,78.5 S1.2 | 112.69,80 112.69,80.92 113.11,81.34 S1.1 | R34.1 110.63,91.05 110.63,80 | 110.63,80 110.63,71.22 106.85,67.44 84.44,67.44 81.18,64.18 U$2.18 | 110.63,80 112.69,80
N$84
  Bottom 1.016: U$2.19 78.64,65.4 83.24,70 94,70 95.49,71.49 95.49,80 | S2.2 98.11,78.5 97.69,78.92 97.69,80 | 97.69,80 97.69,80.92 98.11,81.34 S2.1 | R35.1 95.49,80 | 95.49,80 97.69,80
N$85
  Bottom 1.016: U$2.20 76.1,66.67 80.49,71.06 80.49,80 | 82.69,80 82.69,78.92 83.11,78.5 S3.2 | 82.69,80 82.69,80.92 83.11,81.34 S3.1 | R36.1 80.49,80 | 80.49,80 82.69,80
N$87
  Bottom 1.016: U$2.21 73.56,67.63 71.19,70 67,70 65.49,71.51 65.49,80 | S4.2 68.11,78.5 67.69,78.92 67.69,80 | 67.69,80 67.69,80.92 68.11,81.34 S4.1 | R37.1 65.49,80 | 65.49,80 67.69,80
N$89
  Bottom 1.016: U$2.22 71.02,65.09 68.96,67.15 66.42,67.15 65.15,68.42 52.58,68.42 50.49,70.51 50.49,80 | S5.2 53.11,78.5 52.69,78.92 52.69,80 | 52.69,80 52.69,80.92 53.11,81.34 S5.1 | R38.1 50.49,80 | 50.49,80 52.69,80
N$91  (1 unrouted)
  Bottom 1.016: U$2.23 68.48,63.82 67.69,64.61 65.15,64.61 63.88,65.88 41.02,65.88 35.49,71.41 35.49,80 | 38,86 38.11,85.89 38.11,81.34 37.69,80.92 37.69,80 | S6.2 38.11,78.5 37.69,78.92 37.69,80 | 35.49,80 R39.1 | 35.49,80 37.69,80
N$93
  Bottom 1.016: 35.58,34.42 40.16,39 59,39 63,43 68,43 68.48,43.48 U$2.2 | 35.58,34.42 | 35.58,34.42 35.58,26 | 35.58,26 35.58,15.17 R40.1 | S7.1 38.11,27.69 37.69,27.27 37.69,26 | 37.69,26 37.69,25.27 38.11,24.85 S7.2 | 35.58,26 37.69,26
N$98
  Bottom 1.016: U$2.1 65.7,46.83 32.17,46.83 12,67 12,102 27.86,117.86 U$1.2
N$99
  Bottom 1.016: U$2.10 88.8,48.58 86.74,50.64 33.36,50.64 15,69 15,101 30.4,116.4 U$1.3
N$100
  Bottom 1.016: U$2.11 91.34,49.85 88.01,53.18 34.82,53.18 18,70 18,100 38.02,120.02 U$1.6
N$101
  Bottom 1.016: U$2.14 91.34,59.05 90.55,58.26 37.74,58.26 24,72 24,98 43.1,117.1 U$1.8
N$102
  Bottom 1.016: U$2.13 93.88,57.78 91.82,55.72 36.28,55.72 21,71 21,99 40.56,118.56 U$1.7
N$103
  Bottom 1.016: U$1.12 45.64,150.36 46.91,151.63 59.61,151.63 64.69,156.71 100.25,156.71 106.6,163.06 SR1.14